# EAGLE schematic pcb230424 (EAGLE 9.6.2)
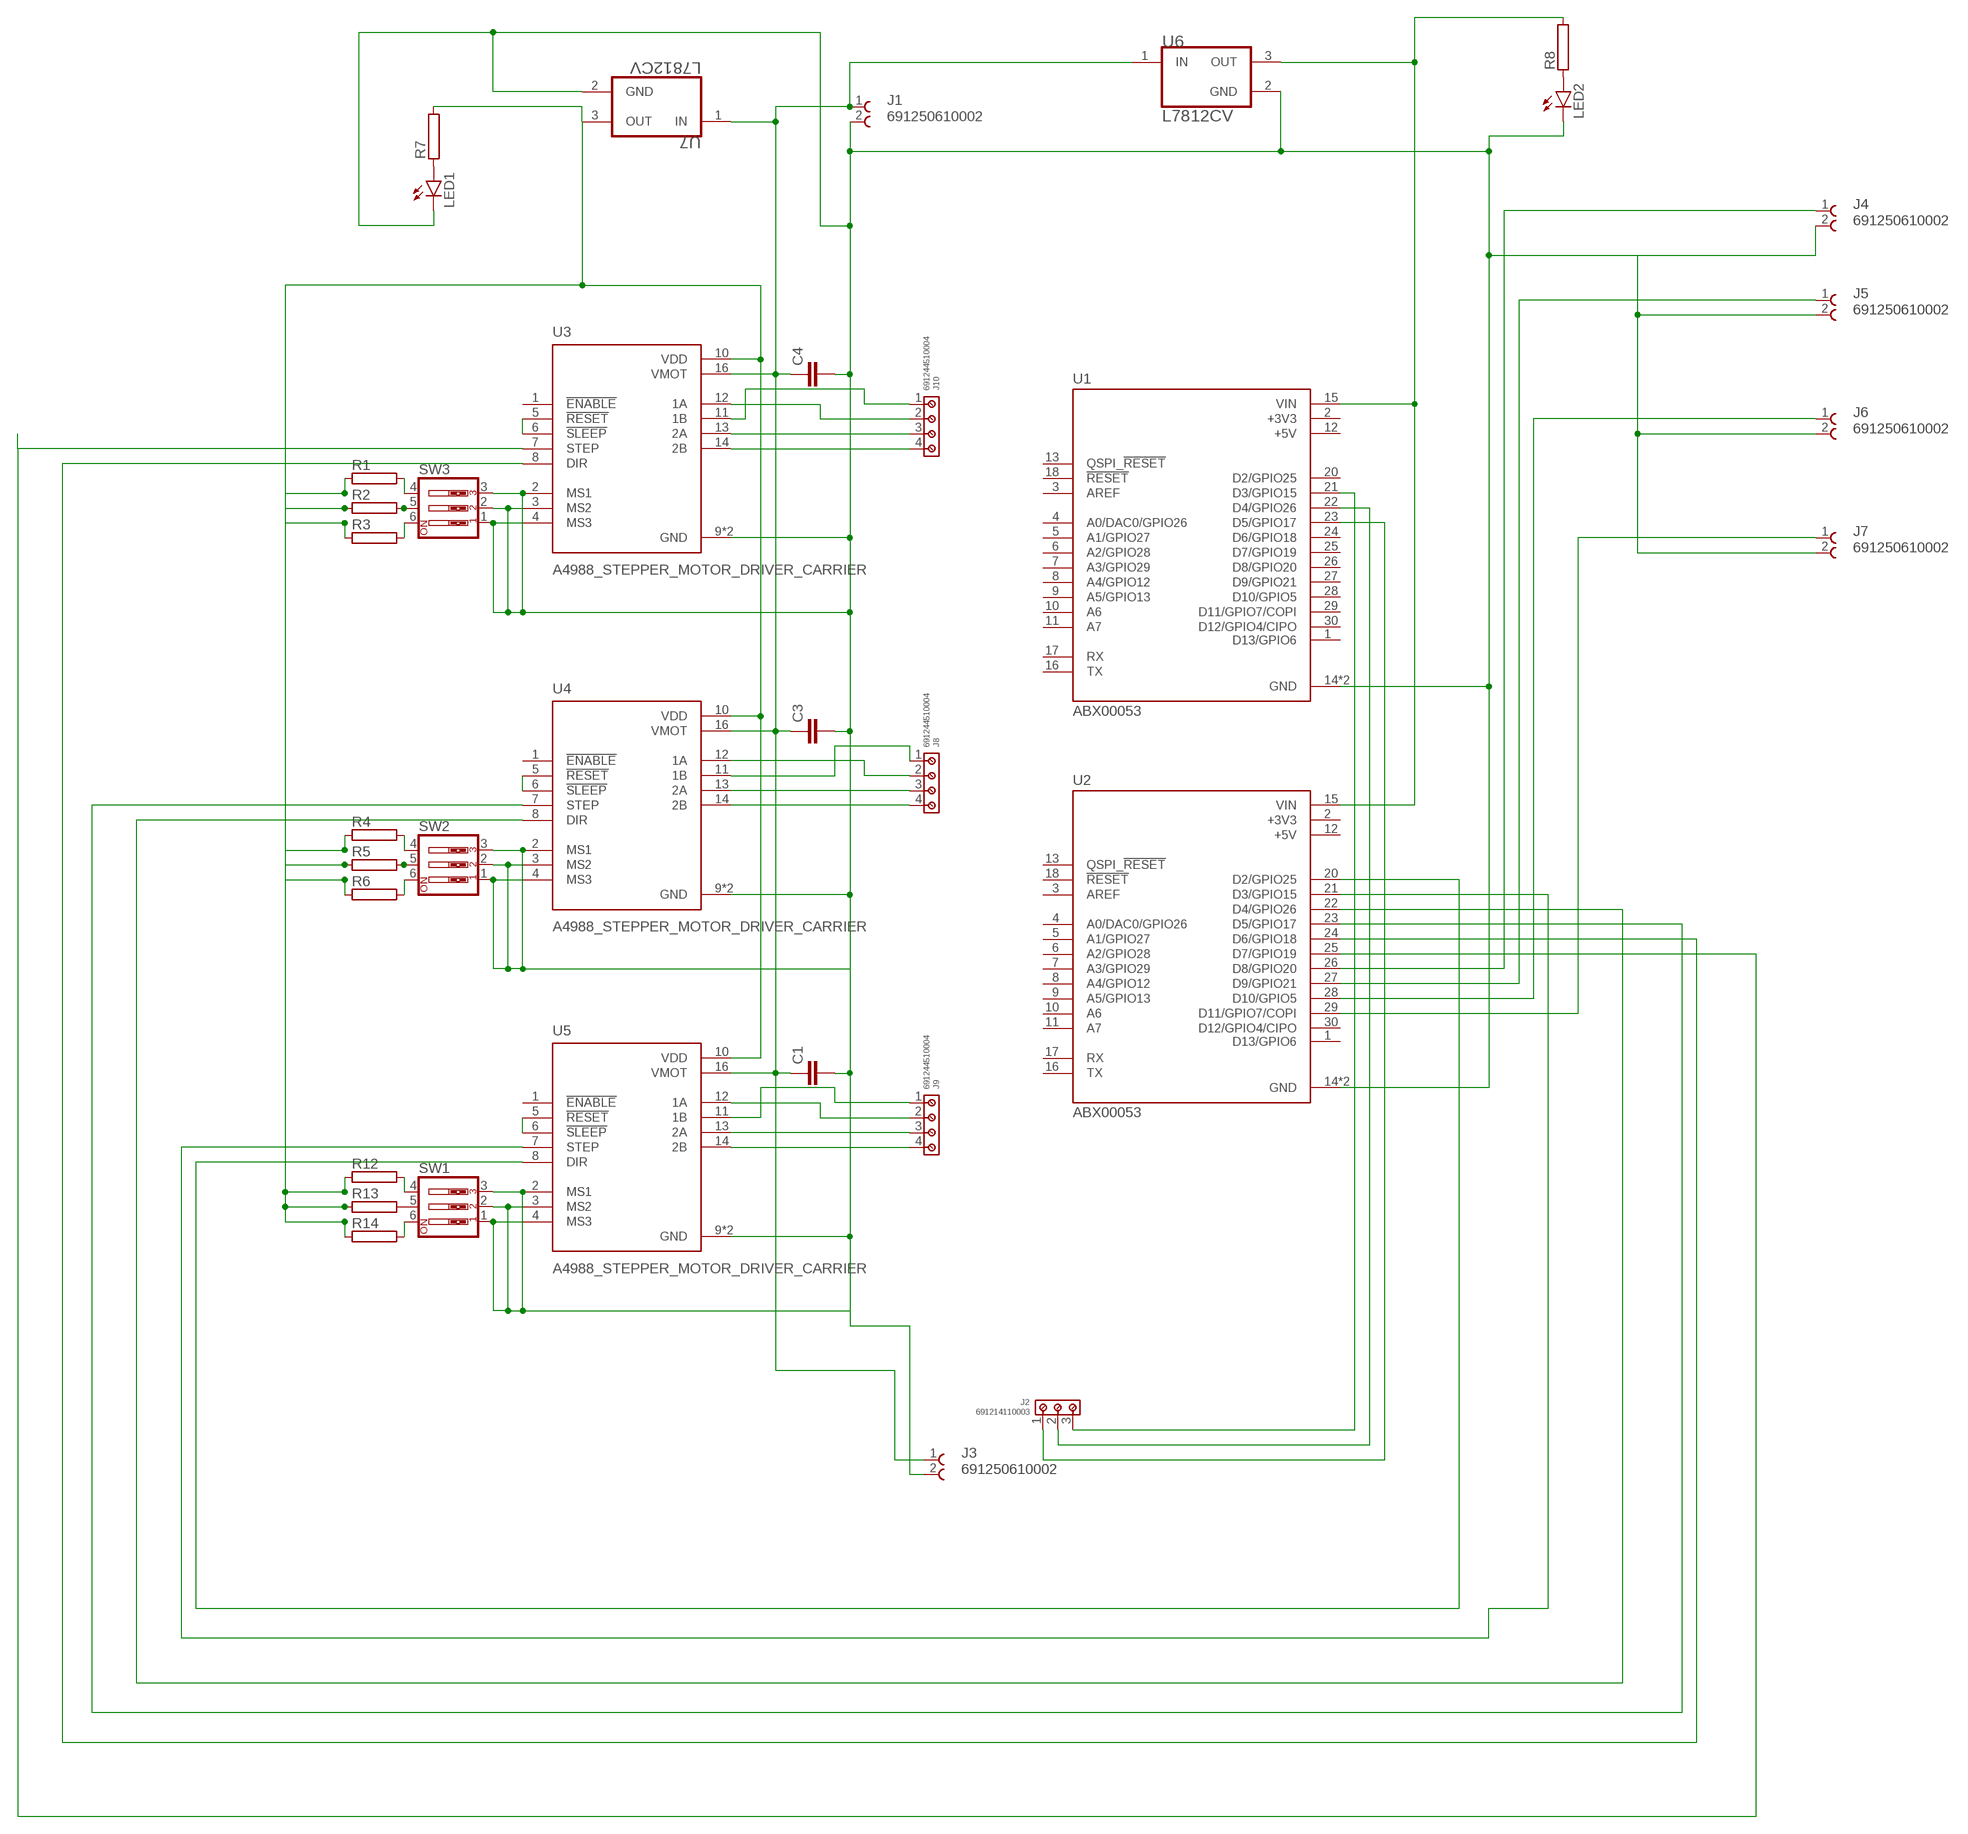
[diagram p0: schematic, sheet 1]

## Parts
C1  C2,5-3  [C2.5-3]
C3  C2,5-3  [C2.5-3]
C4  C2,5-3  [C2.5-3]
J1  691250610002  [691250610002]
J2  691214110003  [691214110003]
J3  691250610002  [691250610002]
J4  691250610002  [691250610002]
J5  691250610002  [691250610002]
J6  691250610002  [691250610002]
J7  691250610002  [691250610002]
J8  691244510004  [691244510004]
J9  691244510004  [691244510004]
J10  691244510004  [691244510004]
LED1  LED3MM  [LED3MM]
LED2  LED3MM  [LED3MM]
R1  RAC01  [AC01]
R2  RAC01  [AC01]
R3  RAC01  [AC01]
R4  RAC01  [AC01]
R5  RAC01  [AC01]
R6  RAC01  [AC01]
R7  RAC01  [AC01]
R8  RAC01  [AC01]
R12  RAC01  [AC01]
R13  RAC01  [AC01]
R14  RAC01  [AC01]
SW1  SW_DIP-3  [EDG-03]
SW2  SW_DIP-3  [EDG-03]
SW3  SW_DIP-3  [EDG-03]
U1  ABX00053  [MODULE_ABX00053]
U2  ABX00053  [MODULE_ABX00053]
U3  A4988_STEPPER_MOTOR_DRIVER_CARRIER  [MODULE_A4988_STEPPER_MOTOR_DRIVER_CARRIER]
U4  A4988_STEPPER_MOTOR_DRIVER_CARRIER  [MODULE_A4988_STEPPER_MOTOR_DRIVER_CARRIER]
U5  A4988_STEPPER_MOTOR_DRIVER_CARRIER  [MODULE_A4988_STEPPER_MOTOR_DRIVER_CARRIER]
U6  L7812CV  [TO-220-3]
U7  L7812CV  [TO-220-3]

## Nets
N$1: U2.25(D7/GPIO19) U3.7(STEP)
N$2: C1.1 C3.1 C4.1 J1.1 J3.1 U3.16(VMOT) U4.16(VMOT) U5.16(VMOT) U6.1(IN) U7.1(IN)
N$3: R8.2 U1.15(VIN) U2.15(VIN) U6.3(OUT)
N$4: J10.2 U3.12(1A)
N$5: U2.24(D6/GPIO18) U3.8(DIR)
N$6: R13.2 SW1.5
N$7: J10.3 U3.13(2A)
N$8: J10.4 U3.14(2B)
N$9: J8.1 U4.11(1B)
N$10: J8.2 U4.12(1A)
N$11: J8.3 U4.13(2A)
N$12: J8.4 U4.14(2B)
N$13: J9.2 U5.12(1A)
N$14: J9.1 U5.11(1B)
N$15: J9.3 U5.13(2A)
N$16: J9.4 U5.14(2B)
N$17: SW1.1 SW1.2 SW1.3 U5.2(MS1) U5.3(MS2) U5.4(MS3)
N$18: U2.22(D4/GPIO26) U4.8(DIR)
N$19: U2.23(D5/GPIO17) U4.7(STEP)
N$20: J10.1 U3.11(1B)
N$21: R7.2 R12.1 R13.1 R14.1 U3.10(VDD) U4.10(VDD) U5.10(VDD) U7.3(OUT)
N$22: U2.20(D2/GPIO25) U5.8(DIR)
N$23: SW2.1 SW2.2 SW2.3 U4.2(MS1) U4.3(MS2) U4.4(MS3)
N$24: U2.21(D3/GPIO15) U5.7(STEP)
N$25: J4.1 U2.26(D8/GPIO20)
N$26: J5.1 U2.27(D9/GPIO21)
N$27: J6.1 U2.28(D10/GPIO5)
N$28: J7.1 U2.29(D11/GPIO7/COPI)
N$29: J2.3 U1.21(D3/GPIO15)
N$30: J2.2 U1.22(D4/GPIO26)
N$31: J2.1 U1.23(D5/GPIO17)
N$32: U3.5(!RESET) U3.6(!SLEEP)
N$33: U4.5(!RESET) U4.6(!SLEEP)
N$34: U5.5(!RESET) U5.6(!SLEEP)
N$35: R12.2 SW1.4
N$36: C1.2 C3.2 C4.2 J1.2 J3.2 J4.2 J5.2 J6.2 J7.2 LED1.K(C) LED2.K(C) SW3.1 SW3.2 SW3.3 U1.14(GND) U1.19(GND) U2.14(GND) U2.19(GND) U3.2(MS1) U3.3(MS2) U3.4(MS3) U3.9(GND) U3.15(GND) U4.9(GND) U4.15(GND) U5.9(GND) U5.15(GND) U6.2(GND) U7.2(GND)
N$37: R14.2 SW1.6
N$38: R4.1 R5.1 R6.1
N$39: R5.2 SW2.5
N$40: R4.2 SW2.4
N$41: R6.2 SW2.6
N$42: R1.1 R2.1 R3.1
N$43: R2.2 SW3.5
N$44: R1.2 SW3.4
N$45: R3.2 SW3.6
N$46: LED1.A R7.1
N$47: LED2.A R8.1
Unconnected: U1.1(D13/GPIO6) U1.3(AREF) U1.4(A0/DAC0/GPIO26) U1.5(A1/GPIO27) U1.6(A2/GPIO28) U1.7(A3/GPIO29) U1.8(A4/GPIO12) U1.9(A5/GPIO13) U1.10(A6) U1.11(A7) U1.13(QSPI_!RESET) U1.16(TX) U1.17(RX) U1.18(!RESET) U1.20(D2/GPIO25) U1.24(D6/GPIO18) U1.25(D7/GPIO19) U1.26(D8/GPIO20) U1.27(D9/GPIO21) U1.28(D10/GPIO5) U1.29(D11/GPIO7/COPI) U1.30(D12/GPIO4/CIPO) U2.1(D13/GPIO6) U2.3(AREF) U2.4(A0/DAC0/GPIO26) U2.5(A1/GPIO27) U2.6(A2/GPIO28) U2.7(A3/GPIO29) U2.8(A4/GPIO12) U2.9(A5/GPIO13) U2.10(A6) U2.11(A7) U2.13(QSPI_!RESET) U2.16(TX) U2.17(RX) U2.18(!RESET) U2.30(D12/GPIO4/CIPO) U3.1(!ENABLE) U4.1(!ENABLE) U5.1(!ENABLE)

## Power pins joined to a net without a drawn wire
+3V3: U1.2(+3V3) U2.2(+3V3)
+5V: U1.12(+5V) U2.12(+5V)

## Library data of the parts
C1 C3 C4 = capacitor-wima:C: CAPACITOR naming: grid - package width
J1 J3-J7 = Terminal_2:691250610002: WR-TBL2 SERIE 2506 - 6.35 MM - HORIZONTAL CABLE ENTRY WITH RISING CAGE CLAMP - 2 pins <http://katalog.we-online.de/media/images/eican/Con_TBL-Screw_RisingClamp_6.35_6912506100xx_pf2.jpg> Details see: http://katalog.we-online.de/en/em/TBL_6_35_2506_HORIZONTAL_ENTRY_W_RISING_CAGE_69125061000x Created on 2015-07-11 2015 (C) Wurth Elektronik Check availability <https://pricing.snapeda.com/parts/691250610002/W%C3%BCrth%20Elektronik/view-part?ref=eda>; AVAILABILITY: In Stock; DESCRIPTION: 6.35 MM TERMINAL BLOCK, HORIZONT; MF: Würth Elektronik; MP: 691250610002; PACKAGE: None; PRICE: None; PURCHASE-URL: https://pricing.snapeda.com/search/part/691250610002/?ref=eda
J2 = Terminal _3:691214110003: WR-TBL Serie 2141 - 3.50 mm Horiz. Entry Modular KIND PROPERTIES Pitch 3.5 mm MATERIAL PROPERTIES Insulator Material PA66 Insulator Flammability Rating UL94 V-0 Insulator Color Green Contact Material Brass Contact Plating Copper over Zinc Terminal Screw Material Steel Terminal Screw Plating Zinc Wire Guard Material Brass GENERAL INFORMATION Operating Temperature -40 up to +105 °C Compliance Lead free / RoHS ELECTRICAL PROPERTIES IR cULus 10 A Working Voltage [cULus] 300 V (AC) Withstanding Voltage [cULus] 1600 V (AC) Contact Resistance [cULus] 20 mΩ MECHANICAL PROPERTIES Wire Strip Length 5 up to 6 (mm) Screw M2 Solid Wire Section (AWG) 24 to 16 (AWG) Solid Wire Section (Metric) 0.205 to 1.31 (mm²) Stranded Wire Section (AWG) 24 to 16 (AWG) Stranded Wire Section (Metric) 0.205 to 1.31 (mm²) CERTIFICATION cULus Approval E315414 PACKAGING PROPERTIES Packaging Box <https://katalog.we-online.com/media/images/v2/o32858v209%20Family_WR-TBL2_Series2141S.jpg> Details see: https://katalog.we-online.com/en/em/TBL_3_50_2141_HORIZONTAL_ENTRY_MODULAR_69121411000X Updated by Ella Wu 2019-11-12 2019(C) Wurth Elektronik Check availability <https://pricing.snapeda.com/parts/691214110003/Wurth%20Elektronik/view-part?ref=eda>; AVAILABILITY: In Stock; DESCRIPTION: 3 Position Wire to Board Terminal Block Horizontal with Board 0.138 (3.50mm) Through Hole; MF: Wurth Elektronik; MP: 691214110003; PACKAGE: None; PRICE: None
J8-J10 = Terminal_4:691244510004: WR-TBL Serie 2445 - 5.08 mm Horizontal Entry Modular w. Rising Cage Clamp KIND PROPERTIES Pitch 5.08 mm MATERIAL PROPERTIES Insulator Material PA66 Insulator Flammability Rating UL94 V-0 Contact Material Copper Alloy Contact Plating Tin over Nickel Terminal Screw Material Steel Terminal Screw Plating Zinc Wire Guard Material Copper Alloy GENERAL INFORMATION Operating Temperature -30 up to +120 °C Compliance RoHS ELECTRICAL PROPERTIES IR cULus 16 A IR VDE 24 A Working Voltage [cULus] 300 V (AC) Working Voltage [VDE] 450 V (AC) Withstanding Voltage [cULus] 1600 V (AC) Withstanding Voltage [VDE] 2500 V (AC) Contact Resistance [cULus] 20 mΩ Contact Resistance [VDE] 20 mΩ MECHANICAL PROPERTIES Wire Strip Length 6 Screw M3 CERTIFICATION cULus Approval E150931 VDE Approval 40015450 PACKAGING PROPERTIES Packaging Box <https://www.we-online.com/catalog/media/o60835v209%20Family_TBL_5_08_2445_HORIZONTAL_CABLE_ENTRY_W_RISING_CAGE_6912445100xx.jpg> Details see: https://www.we-online.com/catalog/en/TBL_5_08_2445_HORIZONTAL_CABLE_ENTRY_W_RISING_CAGE_6912445100xx/ Updated by Ella Wu 2019-11-26 2019(C) Wurth Elektronik Check availability <https://pricing.snapeda.com/parts/691244510004/Wurth%20Electronics/view-part?ref=eda>; AVAILABILITY: In Stock; DESCRIPTION: TB, WIRE TO BRD, R/A, 4WAY, 12AWG;; MF: Wurth Electronics; MP: 691244510004; PACKAGE: None; PRICE: None
LED1 LED2 = led:LED: LED OSRAM: - CHIPLED LG R971, LG N971, LY N971, LG Q971, LY Q971, LO R971, LY R971 LH N974, LH R974 LS Q976, LO Q976, LY Q976 LO Q996 - Hyper CHIPLED LW Q18S LB Q993, LB Q99A, LB R99A - SideLED LS A670, LO A670, LY A670, LG A670, LP A670 LB A673, LV A673, LT A673, LW A673 LH A674 LY A675 LS A676, LA A676, LO A676, LY A676, LW A676 LS A679, LY A679, LG A679 - Hyper Micro SIDELED® LS Y876, LA Y876, LO Y876, LY Y876 LT Y87S - SmartLED LW L88C, LW L88S LB L89C, LB L89S, LG L890 LS L89K, LO L89K, LY L89K LS L896, LA L896, LO L896, LY L896 - TOPLED LS T670, LO T670, LY T670, LG T670, LP T670 LSG T670, LSP T670, LSY T670, LOP T670, LYG T670 LG T671, LOG T671, LSG T671 LB T673, LV T673, LT T673, LW T673 LH T674 LS T676, LA T676, LO T676, LY T676, LB T676, LH T676, LSB T676, LW T676 LB T67C, LV T67C, LT T67C, LS T67K, LO T67K, LY T67K, LW E67C LS E67B, LA E67B, LO E67B, LY E67B, LB E67C, LV E67C, LT E67C LW T67C LS T679, LY T679, LG T679 LS T770, LO T770, LY T770, LG T770, LP T770 LB T773, LV T773, LT T773, LW T773 LH T774 LS E675, LA E675, LY E675, LS T675 LS T776, LA T776, LO T776, LY T776, LB T776 LHGB T686 LT T68C, LB T68C - Hyper Mini TOPLED® LB M676 - Mini TOPLED Santana® LG M470 LS M47K, LO M47K, LY M47K Source: http://www.osram.convergy.de LUXEON: - LUMILED® LXK2-PW12-R00, LXK2-PW12-S00, LXK2-PW14-U00, LXK2-PW14-V00 LXK2-PM12-R00, LXK2-PM12-S00, LXK2-PM14-U00 LXK2-PE12-Q00, LXK2-PE12-R00, LXK2-PE12-S00, LXK2-PE14-T00, LXK2-PE14-U00 LXK2-PB12-K00, LXK2-PB12-L00, LXK2-PB12-M00, LXK2-PB14-N00, LXK2-PB14-P00, LXK2-PB14-Q00 LXK2-PR12-L00, LXK2-PR12-M00, LXK2-PR14-Q00, LXK2-PR14-R00 LXK2-PD12-Q00, LXK2-PD12-R00, LXK2-PD12-S00 LXK2-PH12-R00, LXK2-PH12-S00 LXK2-PL12-P00, LXK2-PL12-Q00, LXK2-PL12-R00 Source: www.luxeon.com KINGBRIGHT: KA-3528ASYC Source: www.kingbright.com
R1-R8 R12-R14 = resistor-power:R: Power Resitor; OC_FARNELL: unknown; OC_NEWARK: unknown
SW1-SW3 = special:SW_DIP-3: DIP SWITCH
U1 U2 = ABX00053:ABX00053: ARDUINO NANO RP2040 CONNECT WITH Check availability <https://pricing.snapeda.com/parts/ABX00053/Arduino/view-part?ref=eda>; AVAILABILITY: In Stock; DESCRIPTION: NINA-W102, RP2040 Arduino Nano RP2040 Connect with Headers series ARM® Cortex®-M0+ MCU 32-Bit Embedded Evaluation Board; MF: Arduino; MP: ABX00053; PACKAGE: None; PRICE: None; PURCHASE-URL: https://pricing.snapeda.com/search/part/ABX00053/?ref=eda
U3-U5 = A4988_STEPPER_MOTOR_DRIVER_CARRIER:A4988_STEPPER_MOTOR_DRIVER_CARRIER: Stepper motor controler; IC: A4988; 1A; Uin mot: 8÷35V Check availability <https://pricing.snapeda.com/parts/A4988%20STEPPER%20MOTOR%20DRIVER%20CARRIER/Pololu/view-part?ref=eda>; AVAILABILITY: Not in stock; DESCRIPTION: Stepper Motor Driver; MF: Pololu; MP: A4988 STEPPER MOTOR DRIVER CARRIER; PACKAGE: None; PRICE: None
U6 U7 = L7812CV:L7812CV: IC REG LINEAR 12V 1.5A TO220AB Check availability <https://pricing.snapeda.com/parts/L7812CV/STMicroelectronics/view-part?ref=eda>; AVAILABILITY: In Stock; DESCRIPTION: Linear Voltage Regulator IC Positive Fixed 1 Output 1.5A TO-220; MF: STMicroelectronics; MP: L7812CV; PACKAGE: TO-220 Texas Instruments; PRICE: None; PURCHASE-URL: https://pricing.snapeda.com/search/part/L7812CV/?ref=eda